# EAGLE design Oxygen Sensor & CO2 PWM (EAGLE 9.5.1)
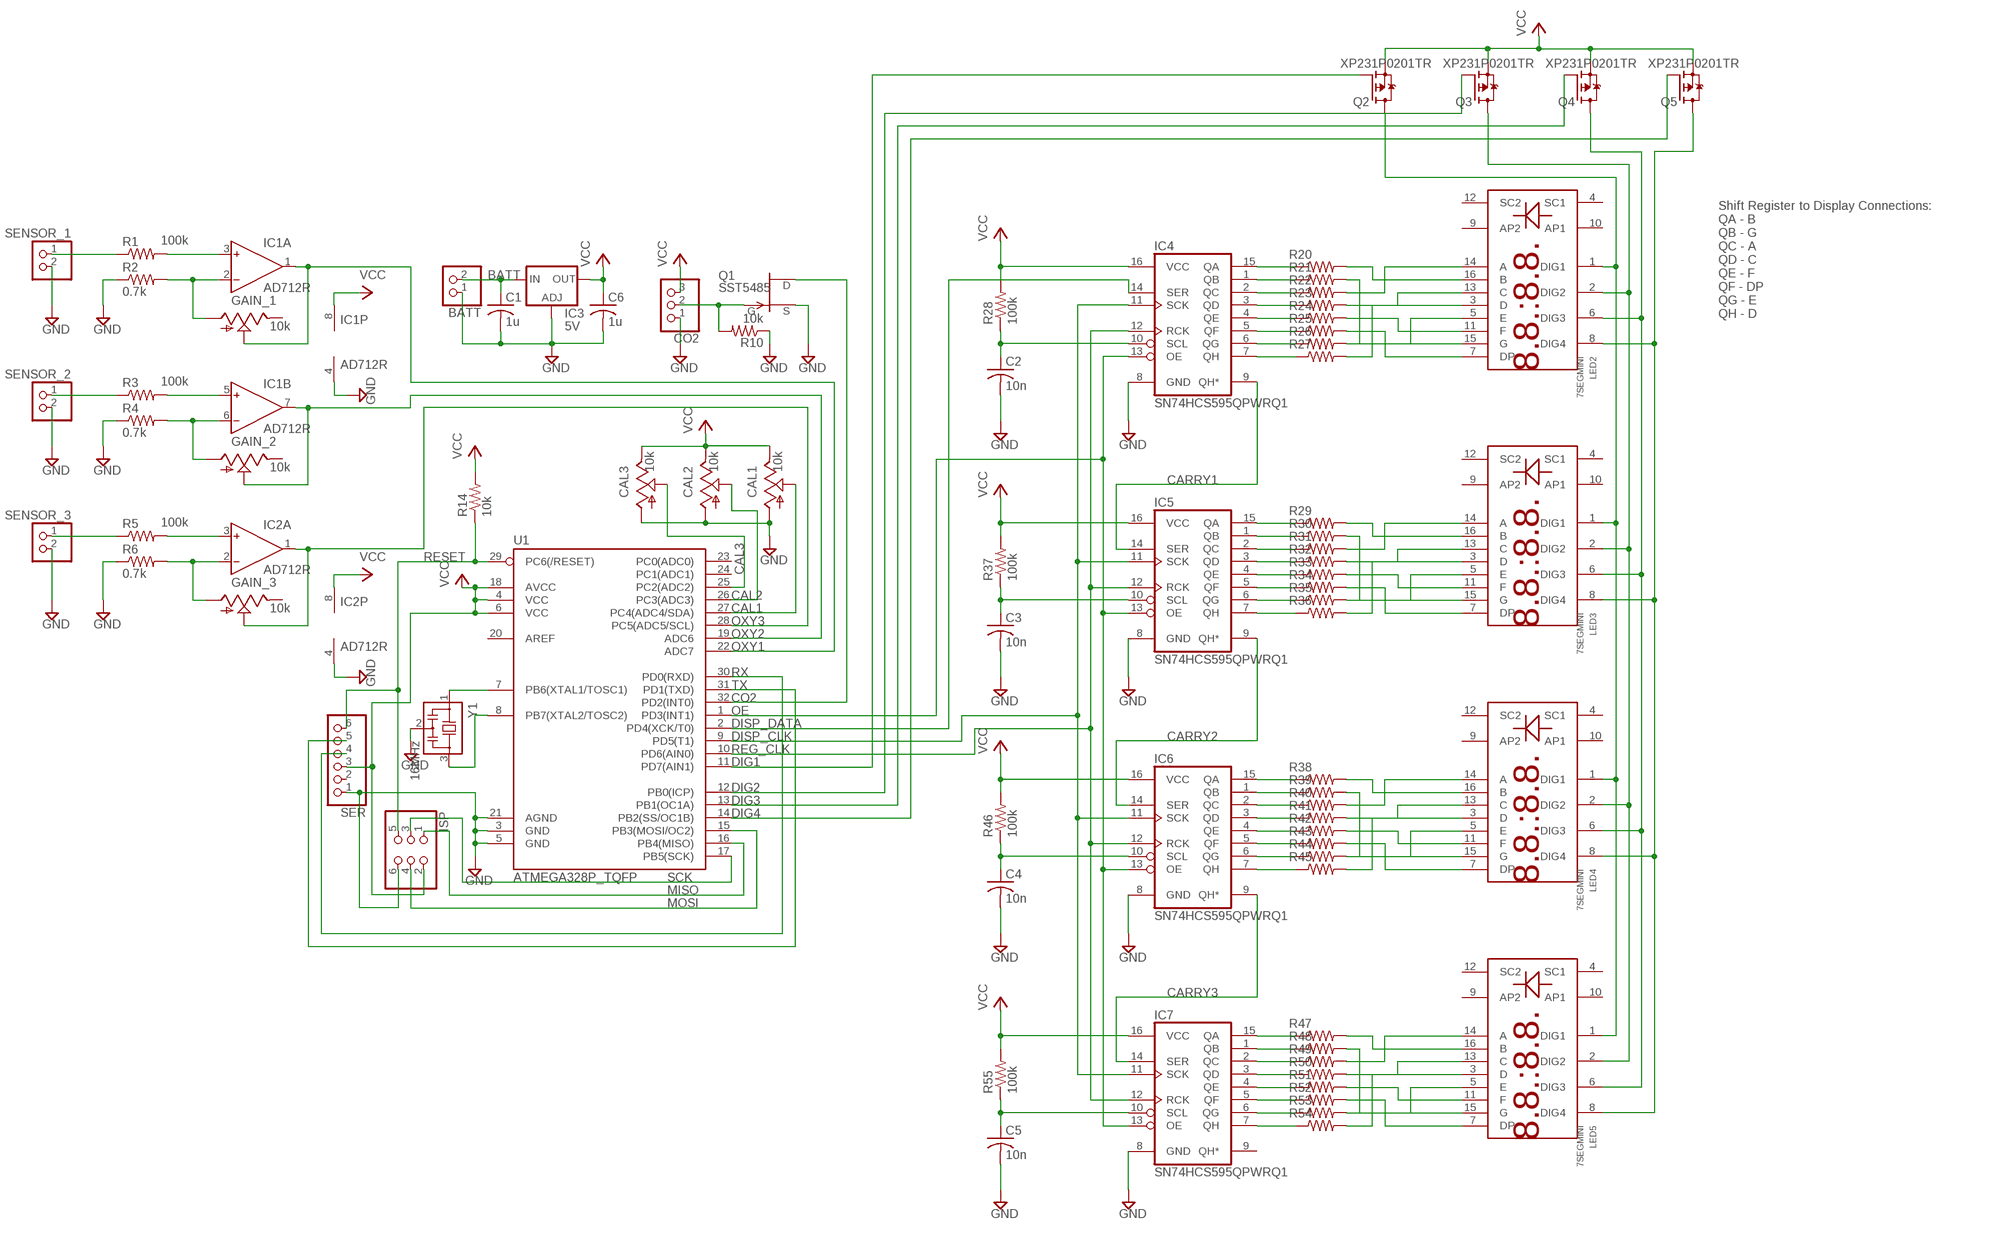
[diagram p0: schematic, sheet 1]

## Parts
BATT  BATT  PINHD-1X2  [1X02]
C1  1u  C-USC0603  [C0603]
C2  10n  C-USC0603  [C0603]
C3  10n  C-USC0603  [C0603]
C4  10n  C-USC0603  [C0603]
C5  10n  C-USC0603  [C0603]
C6  1u  C-USC0603  [C0603]
CAL1  10k  TRIM_US-RJ9W  [RJ9W]
CAL2  10k  TRIM_US-RJ9W  [RJ9W]
CAL3  10k  TRIM_US-RJ9W  [RJ9W]
CO2  CO2  PINHD-1X3  [1X03]
GAIN_1  10k  TRIM_US-RJ9W  [RJ9W]
GAIN_2  10k  TRIM_US-RJ9W  [RJ9W]
GAIN_3  10k  TRIM_US-RJ9W  [RJ9W]
IC1  AD712R  [SO8]
IC2  AD712R  [SO8]
IC3  5V  LD117ASTR  [SOT223]
IC4  SN74HCS595QPWRQ1  [TSSOP16]
IC5  SN74HCS595QPWRQ1  [TSSOP16]
IC6  SN74HCS595QPWRQ1  [TSSOP16]
IC7  SN74HCS595QPWRQ1  [TSSOP16]
ISP  ISP  PINHD-2X3  [2X03]
LED2  7SEGMINI  [7SEGMINI]
LED3  7SEGMINI  [7SEGMINI]
LED4  7SEGMINI  [7SEGMINI]
LED5  7SEGMINI  [7SEGMINI]
Q1  SST5485  [SOT23]
Q2  XP231P0201TR  [SOT23]
Q3  XP231P0201TR  [SOT23]
Q4  XP231P0201TR  [SOT23]
Q5  XP231P0201TR  [SOT23]
R1  100k  R-US_R0603  [R0603]
R2  0.7k  R-US_R0603  [R0603]
R3  100k  R-US_R0603  [R0603]
R4  0.7k  R-US_R0603  [R0603]
R5  100k  R-US_R0603  [R0603]
R6  0.7k  R-US_R0603  [R0603]
R10  10k  R-US_R0603  [R0603]
R14  10k  R-US_R0603  [R0603]
R20  R-US_R0603  [R0603]
R21  R-US_R0603  [R0603]
R22  R-US_R0603  [R0603]
R23  R-US_R0603  [R0603]
R24  R-US_R0603  [R0603]
R25  R-US_R0603  [R0603]
R26  R-US_R0603  [R0603]
R27  R-US_R0603  [R0603]
R28  100k  R-US_R0603  [R0603]
R29  R-US_R0603  [R0603]
R30  R-US_R0603  [R0603]
R31  R-US_R0603  [R0603]
R32  R-US_R0603  [R0603]
R33  R-US_R0603  [R0603]
R34  R-US_R0603  [R0603]
R35  R-US_R0603  [R0603]
R36  R-US_R0603  [R0603]
R37  100k  R-US_R0603  [R0603]
R38  R-US_R0603  [R0603]
R39  R-US_R0603  [R0603]
R40  R-US_R0603  [R0603]
R41  R-US_R0603  [R0603]
R42  R-US_R0603  [R0603]
R43  R-US_R0603  [R0603]
R44  R-US_R0603  [R0603]
R45  R-US_R0603  [R0603]
R46  100k  R-US_R0603  [R0603]
R47  R-US_R0603  [R0603]
R48  R-US_R0603  [R0603]
R49  R-US_R0603  [R0603]
R50  R-US_R0603  [R0603]
R51  R-US_R0603  [R0603]
R52  R-US_R0603  [R0603]
R53  R-US_R0603  [R0603]
R54  R-US_R0603  [R0603]
R55  100k  R-US_R0603  [R0603]
SENSOR_1  PINHD-1X2  [1X02]
SENSOR_2  PINHD-1X2  [1X02]
SENSOR_3  PINHD-1X2  [1X02]
SER  SER  PINHD-1X6  [1X06]
U1  ATMEGA328P_TQFP  [TQFP32-08]
Y1  16MHz  CSTNE16M0V530000R0  [CSTCR6M]

## Nets
BATT: BATT.2 C1.1 IC3.3(IN)
CAL1: CAL1.S U1.27(PC4(ADC4/SDA))
CAL2: CAL2.S U1.26(PC3(ADC3))
CAL3: CAL3.S U1.25(PC2(ADC2))
CARRY1: IC4.9(QH*) IC5.14(SER)
CARRY2: IC5.9(QH*) IC6.14(SER)
CARRY3: IC6.9(QH*) IC7.14(SER)
CO2: Q1.1(D) U1.32(PD2(INT0))
CO2_PWM: CO2.2 Q1.3(G) R10.2
COM_D1: LED2.1(DIG1) LED3.1(DIG1) LED4.1(DIG1) LED5.1(DIG1) Q2.3(D)
COM_D2: LED2.2(DIG2) LED3.2(DIG2) LED4.2(DIG2) LED5.2(DIG2) Q3.3(D)
COM_D3: LED2.6(DIG3) LED3.6(DIG3) LED4.6(DIG3) LED5.6(DIG3) Q4.3(D)
COM_D4: LED2.8(DIG4) LED3.8(DIG4) LED4.8(DIG4) LED5.8(DIG4) Q5.3(D)
DIG1: Q2.1(G) U1.11(PD7(AIN1))
DIG2: Q3.1(G) U1.12(PB0(ICP))
DIG3: Q4.1(G) U1.13(PB1(OC1A))
DIG4: Q5.1(G) U1.14(PB2(SS/OC1B))
DISP_CLK: IC4.11(SCK) IC5.11(SCK) IC6.11(SCK) IC7.11(SCK) U1.9(PD5(T1))
DISP_DATA: IC4.14(SER) U1.2(PD4(XCK/T0))
GND: BATT.1 C1.2 C2.2 C3.2 C4.2 C5.2 C6.2 CAL1.A CAL2.A CAL3.A CO2.1 IC1.4(P:V-) IC2.4(P:V-) IC3.1(ADJ) IC4.8(GND) IC5.8(GND) IC6.8(GND) IC7.8(GND) ISP.6 Q1.2(S) R2.1 R4.1 R6.1 R10.1 SENSOR_1.2 SENSOR_2.2 SENSOR_3.2 SER.1 U1.3(GND) U1.5(GND) U1.21(AGND) Y1.2
MISO: ISP.1 U1.16(PB4(MISO))
MOSI: ISP.4 U1.15(PB3(MOSI/OC2))
N$2: IC1.3(A:IN+) R1.2
N$3: GAIN_1.A IC1.2(A:IN-) R2.2
N$8: IC1.5(B:IN+) R3.2
N$9: GAIN_2.A IC1.6(B:IN-) R4.2
N$11: IC2.3(A:IN+) R5.2
N$12: GAIN_3.A IC2.2(A:IN-) R6.2
N$23: U1.7(PB6(XTAL1/TOSC1)) Y1.1
N$24: U1.8(PB7(XTAL2/TOSC2)) Y1.3
N$30: IC4.15(QA) R20.1
N$31: IC4.1(QB) R21.1
N$32: IC4.2(QC) R22.1
N$33: IC4.3(QD) R23.1
N$34: IC4.4(QE) R24.1
N$35: IC4.5(QF) R25.1
N$36: IC4.6(QG) R26.1
N$37: IC4.7(QH) R27.1
N$38: C2.1 IC4.10(SCL) R28.1
N$39: LED2.16(B) R20.2
N$40: LED2.15(G) R21.2
N$41: LED2.14(A) R22.2
N$42: LED2.13(C) R23.2
N$43: LED2.11(F) R24.2
N$44: LED2.7(DP) R25.2
N$45: LED2.5(E) R26.2
N$46: LED2.3(D) R27.2
N$47: IC5.15(QA) R29.1
N$48: IC5.1(QB) R30.1
N$49: IC5.2(QC) R31.1
N$50: IC5.3(QD) R32.1
N$51: IC5.4(QE) R33.1
N$52: IC5.5(QF) R34.1
N$53: IC5.6(QG) R35.1
N$54: IC5.7(QH) R36.1
N$55: C3.1 IC5.10(SCL) R37.1
N$56: LED3.16(B) R29.2
N$57: LED3.15(G) R30.2
N$58: LED3.14(A) R31.2
N$59: LED3.13(C) R32.2
N$60: LED3.11(F) R33.2
N$61: LED3.7(DP) R34.2
N$62: LED3.5(E) R35.2
N$63: LED3.3(D) R36.2
N$64: IC6.15(QA) R38.1
N$65: IC6.1(QB) R39.1
N$66: IC6.2(QC) R40.1
N$67: IC6.3(QD) R41.1
N$68: IC6.4(QE) R42.1
N$69: IC6.5(QF) R43.1
N$70: IC6.6(QG) R44.1
N$71: IC6.7(QH) R45.1
N$72: C4.1 IC6.10(SCL) R46.1
N$73: LED4.16(B) R38.2
N$74: LED4.15(G) R39.2
N$75: LED4.14(A) R40.2
N$76: LED4.13(C) R41.2
N$77: LED4.11(F) R42.2
N$78: LED4.7(DP) R43.2
N$79: LED4.5(E) R44.2
N$80: LED4.3(D) R45.2
N$81: IC7.15(QA) R47.1
N$82: IC7.1(QB) R48.1
N$83: IC7.2(QC) R49.1
N$84: IC7.3(QD) R50.1
N$85: IC7.4(QE) R51.1
N$86: IC7.5(QF) R52.1
N$87: IC7.6(QG) R53.1
N$88: IC7.7(QH) R54.1
N$89: C5.1 IC7.10(SCL) R55.1
N$90: LED5.16(B) R47.2
N$91: LED5.15(G) R48.2
N$92: LED5.14(A) R49.2
N$93: LED5.13(C) R50.2
N$94: LED5.11(F) R51.2
N$95: LED5.7(DP) R52.2
N$96: LED5.5(E) R53.2
N$97: LED5.3(D) R54.2
O2SENS_1: R1.1 SENSOR_1.1
O2SENS_2: R3.1 SENSOR_2.1
O2SENS_3: R5.1 SENSOR_3.1
OE: IC4.13(OE) IC5.13(OE) IC6.13(OE) IC7.13(OE) U1.1(PD3(INT1))
OXY1: GAIN_1.S IC1.1(A:OUT) U1.22(ADC7)
OXY2: GAIN_2.S IC1.7(B:OUT) U1.19(ADC6)
OXY3: GAIN_3.S IC2.1(A:OUT) U1.28(PC5(ADC5/SCL))
REG_CLK: IC4.12(RCK) IC5.12(RCK) IC6.12(RCK) IC7.12(RCK) U1.10(PD6(AIN0))
RESET: ISP.5 R14.1 SER.6 U1.29(PC6(/RESET))
RX: SER.4 U1.30(PD0(RXD))
SCK: ISP.3 U1.17(PB5(SCK))
TX: SER.5 U1.31(PD1(TXD))
VCC: C6.1 CAL1.E CAL2.E CAL3.E CO2.3 IC1.8(P:V+) IC2.8(P:V+) IC3.4(OUT) IC4.16(VCC) IC5.16(VCC) IC6.16(VCC) IC7.16(VCC) ISP.2 Q2.2(S) Q3.2(S) Q4.2(S) Q5.2(S) R14.2 R28.2 R37.2 R46.2 R55.2 SER.3 U1.4(VCC) U1.6(VCC) U1.18(AVCC)
Unconnected: GAIN_1.E GAIN_2.E GAIN_3.E IC2.5(B:IN+) IC2.6(B:IN-) IC2.7(B:OUT) IC7.9(QH*) LED2.4(SC1) LED2.9(AP2) LED2.10(AP1) LED2.12(SC2) LED3.4(SC1) LED3.9(AP2) LED3.10(AP1) LED3.12(SC2) LED4.4(SC1) LED4.9(AP2) LED4.10(AP1) LED4.12(SC2) LED5.4(SC1) LED5.9(AP2) LED5.10(AP1) LED5.12(SC2) SER.2 U1.20(AREF) U1.23(PC0(ADC0)) U1.24(PC1(ADC1))

## Notes on the sheet
- Shift Register to Display Connections:
  QA - B
  QB - G
  QC - A
  QD - C
  QE - F
  QF - DP
  QG - E
  QH - D

## Library data of the parts
BATT SENSOR_1-SENSOR_3 = pinhead:PINHD-1X2: PIN HEADER
C1-C6 = rcl:C-US: CAPACITOR, American symbol; SPICEPREFIX: C
CAL1-CAL3 GAIN_1-GAIN_3 = pot:TRIM_US-: POTENTIOMETER
CO2 = pinhead:PINHD-1X3: PIN HEADER
IC1 IC2 = analog-devices:AD712: Dual Precision, Low Cost, High Speed BiFET Op Amp Source: http://www.analog.com/static/imported-files/data_sheets/AD712.pdf; MF: ALTERA CORPORATION; MPN: AD712KRZ; OC_FARNELL: 1263975; OC_NEWARK: 59K4556
IC3 = v-reg:LD117A?*: Low drop fixed and adjustable positive voltage regulators 1 A Source: http://www.st.com/stonline/products/literature/ds/7194/ld1117axx.pdf
IC4-IC7 = axios_components:SN74HCS595QPWRQ1
ISP = pinhead:PINHD-2X3: PIN HEADER
LED2-LED5 = axios_components:7SEGMINI
Q1 = transistor-fet:?548*: N-Channel JFETs Source: VISHAY 2N5484.pdf Compatible: TO92 2N5245 J304 J305 U310 J308 J309 J310 TO72 2N4416 2N4416A 2N3823 2N4351 3N169 3N170 3N171 MFE3002 TO18 2N3796 2N3797 MFE825 Source: Motorola European Master Guide Pacge 3-59
Q2-Q5 = axios_components:XP231P0201TR: P-Channel Enhancement mode MOSFET 200 mA
R1-R6 R10 R14 R20-R55 = rcl:R-US_: RESISTOR, American symbol; SPICEPREFIX: R
SER = pinhead:PINHD-1X6: PIN HEADER
U1 = axios_components:ATMEGA328P_TQFP: Popular 328P in QFP Storefront component: ATmega328 - TQFP <https://www.sparkfun.com/products/13448> (COM-13448) Datasheet <http://www.sparkfun.com/datasheets/Components/SMD/ATMega328.pdf> SparkFun Products SparkFun RedBoard - Programmed with Arduino <https://www.sparkfun.com/products/12757> (DEV-12757) Arduino Pro Mini 328 - 5V/16MHz <https://www.sparkfun.com/products/11113> (DEV-11113) Arduino Pro Mini 328 - 3.3V/8MHz <https://www.sparkfun.com/products/11114> (DEV-11114) SparkFun OpenLog <https://www.sparkfun.com/products/13712> (DEV-13712) SparkFun MicroView - OLED Arduino Module <https://www.sparkfun.com/products/12923> (DEV-12923) SparkFun Digital Sandbox <https://www.sparkfun.com/products/12651> (DEV-12651) SparkFun PicoBoard <https://www.sparkfun.com/products/11888> (WIG-11888) Arduino Fio <https://www.sparkfun.com/products/10116> (DEV-10116) LilyPad Arduino 328 Main Board <https://www.sparkfun.com/products/13342> (DEV-13342) SparkFun RedStick <https://www.sparkfun.com/products/13741> (DEV-13741) LilyPad MP3 <https://www.sparkfun.com/products/11013> (DEV-11013) LilyPad Arduino SimpleSnap <https://www.sparkfun.com/products/10941> (DEV-10941) SparkFun Stepoko <https://www.sparkfun.com/products/13899> (ROB-13899) SparkFun Geiger Counter <https://www.sparkfun.com/products/11345> (SEN-11345) SparkFun EL Sequencer <https://www.sparkfun.com/products/12781> (COM-12781) Arduino Pro 328 - 5V/16MHz <https://www.sparkfun.com/products/10915> (DEV-10915) CryptoCape <https://www.sparkfun.com/products/12773> (DEV-12773) SparkFun IR Thermometer Evaluation Board - MLX90614 <https://www.sparkfun.com/products/10740> (SEN-10740) SparkFun RedBot Mainboard <https://www.sparkfun.com/products/12097> (ROB-12097) Arduino Pro 328 - 3.3V/8MHz <https://www.sparkfun.com/products/10914> (DEV-10914) SparkFun Block for Intel® Edison - Arduino <https://www.sparkfun.com/products/13036> (DEV-13036) SparkFun Simon Says - Surface Mount Soldering Kit <https://www.sparkfun.com/products/10935> (KIT-10935) SparkFun 7-Segment Serial Display - Red <https://www.sparkfun.com/products/11441> (COM-11441) SparkFun 7-Segment Serial Display - White <https://www.sparkfun.com/products/11629> (COM-11629) SparkFun 7-Segment Serial Display - Yellow <https://www.sparkfun.com/products/11443> (COM-11443) SparkFun 7-Segment Serial Display - Kelly Green <https://www.sparkfun.com/products/11440> (COM-11440) SparkFun 7-Segment Serial Display - Blue <https://www.sparkfun.com/products/11442> (COM-11442) SparkFun OpenSegment Serial Display - 20mm (Blue) <https://www.sparkfun.com/products/11647> (COM-11647) SparkFun OpenSegment Serial Display - 20mm (Green) <https://www.sparkfun.com/products/11646> (COM-11646) SparkFun OpenSegment Serial Display - 20mm (White) <https://www.sparkfun.com/products/11648> (COM-11648) SparkFun OpenSegment Serial Display - 20mm (Red) <https://www.sparkfun.com/products/11644> (COM-11644) SparkFun OpenSegment Serial Display - 20mm (Yellow) <https://www.sparkfun.com/products/11645> (COM-11645) SparkFun OpenSegment Shield <https://www.sparkfun.com/products/13190> (DEV-13190); PROD_ID: IC-09069
Y1 = axios_components:CSTNE16M0V530000R0

## Board
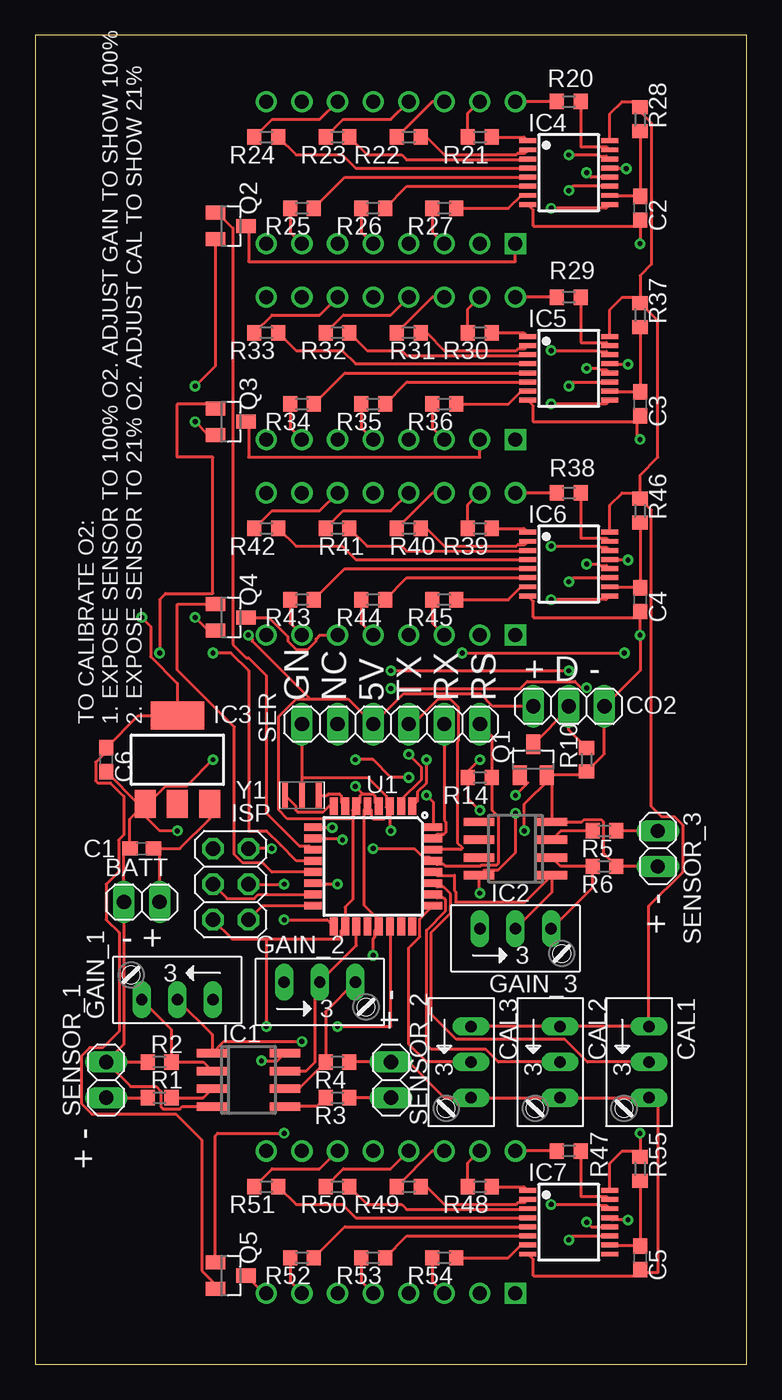
[diagram p1: board, top side]
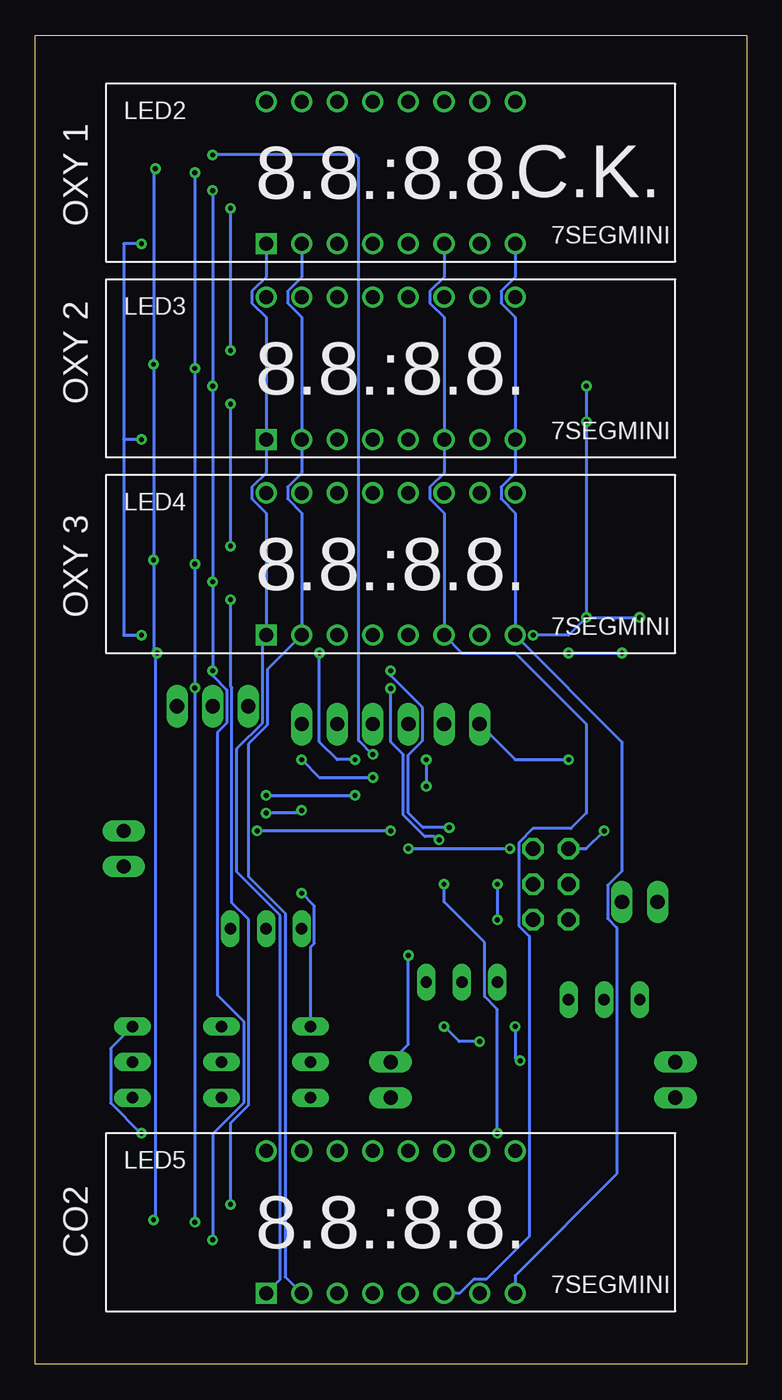
[diagram p2: board, bottom side, seen from below]

Size 50.78 x 94.92 mm. Coordinates in mm from the lower left corner, seen from the top.
Outline: 0,0 50.78,0 50.78,94.92 0,94.92 0,0
Copper layers (1*16): Top 0.035mm / dielectric 1.5mm / Bottom 0.035mm
Design rules "default": minimum track width 6mil, minimum drill 0.35mm, track to track 6mil, track to pad 6mil, pad to pad 6mil, via to via 6mil, smd to smd 6mil, copper to edge 40mil, drill to drill 6mil, minimum pad ring 10mil, minimum via ring 8mil, stop-mask expansion 4mil, vias tented up to drill 0mil, thermal gap 10mil

### Footprints (pad centres in the part's own frame; a part is rotated, then mirrored left to right if it is on the bottom)
1X02 = drill 1.016 long: 1 -1.27,0; 2 1.27,0
C0603 = smd 1.1 x 1: 1 -0.85,0; 2 0.85,0
RJ9W = drill 0.813 long: A 2.54,0.635; E -2.54,0.635; S 0,0.635
1X03 = drill 1.016 long: 1 -2.54,0; 2 0,0; 3 2.54,0
SO8 = smd 0.6 x 2.2: 1 -1.905,-2.6; 2 -0.635,-2.6; 3 0.635,-2.6; 4 1.905,-2.6; 5 1.905,2.6; 6 0.635,2.6; 7 -0.635,2.6; 8 -1.905,2.6
SOT223 = smd 1.5 x 2: 1 -2.3,-3.15; 2 0,-3.15; 3 2.3,-3.15 | smd 3.8 x 2: 4 0,3.15
TSSOP16 = smd 0.35 x 1.2: 1 -2.275,-2.925; 2 -1.625,-2.925; 3 -0.975,-2.925; 4 -0.325,-2.925; 5 0.325,-2.925; 6 0.975,-2.925; 7 1.625,-2.925; 8 2.275,-2.925; 9 2.275,2.925; 10 1.625,2.925; 11 0.975,2.925; 12 0.325,2.925; 13 -0.325,2.925; 14 -0.975,2.925; 15 -1.625,2.925; 16 -2.275,2.925
2X03 = drill 1.016 octagon: 1 -2.54,-1.27; 2 -2.54,1.27; 3 0,-1.27; 4 0,1.27; 5 2.54,-1.27; 6 2.54,1.27
7SEGMINI = drill 1 square: 1 -8.89,-5.08 | drill 1: 2 -6.35,-5.08; 3 -3.81,-5.08; 4 -1.27,-5.08; 5 1.27,-5.08; 6 3.81,-5.08; 7 6.35,-5.08; 8 8.89,-5.08; 9 8.89,5.08; 10 6.35,5.08; 11 3.81,5.08; 12 1.27,5.08; 13 -1.27,5.08; 14 -3.81,5.08; 15 -6.35,5.08; 16 -8.89,5.08
SOT23 = smd 1 x 1.4: 1 -0.95,-1.1; 2 0.95,-1.1; 3 0,1.1
R0603 = smd 1 x 1.1: 1 -0.85,0; 2 0.85,0
1X06 = drill 1.016 long: 1 -6.35,0; 2 -3.81,0; 3 -1.27,0; 4 1.27,0; 5 3.81,0; 6 6.35,0
TQFP32-08 = smd 1.27 x 0.559: 1 -4.293,2.8; 2 -4.293,2; 3 -4.293,1.2; 4 -4.293,0.4; 5 -4.293,-0.4; 6 -4.293,-1.2; 7 -4.293,-2; 8 -4.293,-2.8; 17 4.293,-2.8; 18 4.293,-2; 19 4.293,-1.2; 20 4.293,-0.4; 21 4.293,0.4; 22 4.293,1.2; 23 4.293,2; 24 4.293,2.8 | smd 0.559 x 1.27: 9 -2.8,-4.293; 10 -2,-4.293; 11 -1.2,-4.293; 12 -0.4,-4.293; 13 0.4,-4.293; 14 1.2,-4.293; 15 2,-4.293; 16 2.8,-4.293; 25 2.8,4.293; 26 2,4.293; 27 1.2,4.293; 28 0.4,4.293; 29 -0.4,4.293; 30 -1.2,4.293; 31 -2,4.293; 32 -2.8,4.293
CSTCR6M = smd 0.4 x 1.9: 1 -1.2,0; 2 0,0; 3 1.2,0

### Placement (x,y rotation side)
BATT  7.62,33.02 0 top
C1  7.62,36.83 180 top
C2  43.18,82.55 270 top
C3  43.18,68.58 270 top
C4  43.18,54.61 270 top
C5  43.18,7.62 270 top
C6  5.08,43.18 270 top
CAL1  43.18,21.59 270 top
CAL2  36.83,21.59 270 top
CAL3  30.48,21.59 270 top
CO2  38.1,46.99 180 top
GAIN_1  10.16,26.67 180 top
GAIN_2  20.32,26.67 0 top
GAIN_3  34.29,30.48 0 top
IC1  15.24,20.32 270 top
IC2  34.29,36.83 90 top
IC3  10.16,43.18 0 top
IC4  38.1,85.09 270 top
IC5  38.1,71.12 270 top
IC6  38.1,57.15 270 top
IC7  38.1,10.16 270 top
ISP  13.97,34.29 90 top
LED2  25.4,85.09 0 bottom
LED3  25.4,71.12 0 bottom
LED4  25.4,57.15 0 bottom
LED5  25.4,10.16 0 bottom
Q1  35.56,43.18 0 top
Q2  13.97,81.28 270 top
Q3  13.97,67.31 270 top
Q4  13.97,53.34 270 top
Q5  13.97,6.35 270 top
R1  8.89,19.05 0 top
R2  8.89,21.59 0 top
R3  21.59,19.05 180 top
R4  21.59,21.59 180 top
R5  40.64,38.1 180 top
R6  40.64,35.56 180 top
R10  39.37,43.18 90 top
R14  31.75,41.91 180 top
R20  38.1,90.17 180 top
R21  31.75,87.63 180 top
R22  26.67,87.63 180 top
R23  21.59,87.63 180 top
R24  16.51,87.63 180 top
R25  19.05,82.55 180 top
R26  24.13,82.55 180 top
R27  29.21,82.55 180 top
R28  43.18,88.9 90 top
R29  38.1,76.2 180 top
R30  31.75,73.66 180 top
R31  26.67,73.66 180 top
R32  21.59,73.66 180 top
R33  16.51,73.66 180 top
R34  19.05,68.58 180 top
R35  24.13,68.58 180 top
R36  29.21,68.58 180 top
R37  43.18,74.93 90 top
R38  38.1,62.23 180 top
R39  31.75,59.69 180 top
R40  26.67,59.69 180 top
R41  21.59,59.69 180 top
R42  16.51,59.69 180 top
R43  19.05,54.61 180 top
R44  24.13,54.61 180 top
R45  29.21,54.61 180 top
R46  43.18,60.96 90 top
R47  38.1,15.24 180 top
R48  31.75,12.7 180 top
R49  26.67,12.7 180 top
R50  21.59,12.7 180 top
R51  16.51,12.7 180 top
R52  19.05,7.62 180 top
R53  24.13,7.62 180 top
R54  29.21,7.62 180 top
R55  43.18,13.97 90 top
SENSOR_1  5.08,20.32 90 top
SENSOR_2  25.4,20.32 90 top
SENSOR_3  44.45,36.83 270 top
SER  25.4,45.72 0 top
U1  24.13,35.56 270 top
Y1  19.05,40.64 180 top

### Tracks (layer width: path | path; a pad name or v marks a point on that pad's centre or on a via)
BATT
  Top 0.203: BATT.2 8.89,36.41 C1.1 10.34,36.83 12.46,38.95 IC3.3
CAL1
  Top 0.203: CAL1.S 39.42,21.59 37.79,23.22 30.08,23.22 28.3,25 28.3,30.86 29.67,32.23 29.67,33.59 29.16,34.09 28.69,34.09 U1.27
CAL2
  Top 0.203: CAL2.S 33.07,21.59 32.15,22.5 28.3,22.5 27.94,22.86 27.94,31 29.31,32.38 29.31,33.15 29.16,33.29 28.69,33.29 U1.26
CAL3
  Top 0.203: CAL3.S 27.94,21.59 26.67,22.86 26.67,29.73 27.46,30.53 27.46,31.8 U1.25
CARRY1  (via drill 0.35)
  Top 0.203: IC4.9 40.76,82.55 v36.83,82.55 | v36.83,72.39 40.25,72.39 40.32,72.32 40.8,72.32 IC5.14
  Bottom 0.203: v36.83,82.55 v36.83,72.39
CARRY2  (via drill 0.35)
  Top 0.203: IC5.9 40.76,68.58 v36.83,68.58 | v36.83,58.42 40.25,58.42 40.32,58.35 40.8,58.35 IC6.14
  Bottom 0.203: v36.83,68.58 v36.83,58.42
CARRY3  (via drill 0.35)
  Top 0.203: IC6.9 40.76,54.61 v36.83,54.61 | v36.83,11.43 40.25,11.43 40.32,11.36 40.8,11.36 IC7.14
  Bottom 0.203: v36.83,54.61 36.83,48.42 36.73,48.32 36.73,32.97 35.54,31.77 35.54,18.52 36.83,17.23 v36.83,11.43
CO2  (via drill 0.35)
  Top 0.203: Q1.1 35.17,41.52 v34.29,40.64 | v27.94,40.64 28.42,40.16 U1.32
  Bottom 0.203: v34.29,40.64 v27.94,40.64
CO2_PWM
  Top 0.203: R10.2 38.1,45.3 CO2.2 38.1,46.82 Q1.3
COM_D1
  Top 0.203: Q2.3 15.24,81.11 15.24,78.74 34.29,78.74 LED2.1
  Bottom 0.203: LED2.1 34.29,77.63 35.3,76.62 35.3,75.78 34.29,74.77 LED3.1 34.29,63.66 35.3,62.65 35.3,61.81 34.29,60.8 LED4.1 34.54,51.82 34.54,45.81 36.37,43.98 36.37,35.15 33.28,32.06 33.28,6.09 LED5.1
COM_D2
  Top 0.203: Q3.3 15.24,67.14 15.24,64.77 31.75,64.77 LED3.2
  Bottom 0.203: LED2.2 31.75,77.63 32.76,76.62 32.76,75.78 31.75,74.77 LED3.2 31.75,63.66 32.76,62.65 32.76,61.81 31.75,60.8 LED4.2 34.19,49.63 34.19,45.66 35.56,44.29 35.56,34.84 32.93,32.21 32.93,6.26 LED5.2
COM_D3
  Top 0.203: Q4.3 16.67,53.34 18.04,51.96 18.04,51.65 18.63,51.06 19.47,51.06 20.06,51.65 20.06,51.81 20.32,52.07 LED4.6
  Bottom 0.203: LED2.6 21.59,77.63 22.6,76.62 22.6,75.78 21.59,74.77 LED3.6 21.59,63.66 22.6,62.65 22.6,61.81 21.59,60.8 LED4.6 20.32,50.8 16.51,50.8 11.43,45.72 11.43,39.37 12.53,38.27 15.24,38.27 16.26,37.25 16.26,31.33 15.5,30.57 15.5,9.15 18.57,6.09 19.47,6.09 20.48,5.08 LED5.6
COM_D4
  Top 0.203: Q5.3 16.34,5.08 LED5.8
  Bottom 0.203: LED2.8 16.51,77.63 17.52,76.62 17.52,75.78 16.51,74.77 LED3.8 16.51,63.66 17.52,62.65 17.52,61.81 16.51,60.8 LED4.8 8.89,44.45 8.89,35.22 9.91,34.2 9.91,31.84 9.25,31.18 9.25,13.61 16.51,6.35 LED5.8
DIG1
  Top 0.203: U1.11 19.57,37.03 18.85,37.03 16.51,39.37 16.51,49.17 15.24,50.44 15.09,50.44 14.12,51.42 14.12,81.13 13.02,82.23 Q2.1
DIG2  (via drill 0.35)
  Top 0.152: 12.55,68.58 Q3.1
  Top 0.203: U1.12 18.65,35.96 17.52,37.09 16.51,38.1 15.24,38.1 15.24,49.53 13.97,50.8 v12.7,50.8 | v8.89,50.8 8.89,54.61 9.32,55.04 12.7,55.04 12.7,64.77 10.16,64.77 10.16,68.58 12.55,68.58
  Bottom 0.203: v12.7,50.8 v8.89,50.8
DIG3
  Top 0.203: U1.13 16.91,35.16 16.26,35.81 14.82,35.81 14.22,36.41 14.22,45.52 10.16,49.59 10.16,54.29 Q4.1
DIG4  (via drill 0.35)
  Top 0.203: Q5.1 12.87,16.34 13.04,16.51 v17.78,16.51 | v21.59,34.29 19.91,34.29 U1.14
  Bottom 0.203: v17.78,16.51 17.78,25.35 18.69,26.27 18.69,30.12 21.59,33.02 v21.59,34.29
DISP_CLK  (via drill 0.35)
  Top 0.203: IC4.11 38.4,84.11 v38.1,83.82 | v38.1,69.85 38.4,70.14 IC5.11 | v38.1,55.88 38.4,56.17 IC6.11 | v38.1,8.89 38.4,9.19 IC7.11 | U1.9 21.19,38.36 v21.22,38.33 | v25.4,49.53 v38.1,49.53
  Bottom 0.203: v38.1,83.82 v38.1,69.85 v38.1,55.88 v38.1,49.53 38.1,49.19 37.08,48.17 37.08,45.81 37.74,45.15 37.74,26.36 35.89,24.51 35.89,18.67 38.1,16.46 v38.1,8.89 | v21.22,38.33 23.09,38.33 24.13,39.37 24.13,43.52 23.11,44.54 23.11,46.9 25.4,49.19 v25.4,49.53
DISP_DATA  (via drill 0.35)
  Top 0.203: v38.1,86.36 40.25,86.36 40.32,86.29 40.8,86.29 IC4.14 | U1.2 26.13,40.33 27.58,41.78 27.58,42.64 27.31,42.92 v26.67,43.56
  Bottom 0.203: v26.67,43.56 26.71,43.56 27.69,44.54 27.69,86.11 27.94,86.36 v38.1,86.36
GND  (via drill 0.35)
  Top 0.203: IC4.8 35.56,82.43 35.56,81.28 42.76,81.28 C2.2 v43.18,80.01 | 42.97,67.52 42.76,67.31 35.56,67.31 35.56,68.46 IC5.8 | 42.97,67.52 C3.2 | IC6.8 35.56,54.49 35.56,53.34 42.76,53.34 C4.2 v43.18,52.07 43.18,49.53 CO2.1 40.64,43.6 R10.1 39.12,42.08 Q1.2 36.76,41.84 | 42.97,6.56 42.76,6.35 35.56,6.35 35.56,7.5 IC7.8 | 42.97,6.56 C5.2 | SENSOR_3.2 R6.1 40.54,36.51 40.54,38.76 40.4,38.9 39.19,38.9 39.02,38.73 IC2.4 36.89,41.7 36.76,41.84 | R4.1 SENSOR_2.2 26.67,21.59 29.21,19.05 CAL3.A CAL2.A CAL1.A 44.45,18.41 44.45,6.56 42.97,6.56 | SENSOR_1.2 R2.1 | 7.41,39.58 6.77,38.94 C1.2 6.35,36.41 BATT.1 6.35,22.86 SENSOR_1.2 | 7.41,39.58 IC3.1 | C6.2 7.38,40.03 IC3.1 | 25.33,39.37 U1.3 25.33,38.17 v25.4,38.1 | 25.33,39.37 25.32,39.37 24.91,38.96 24.14,38.96 24,39.11 24,39.59 U1.5 23.46,39.59 23.46,32.81 24.53,31.74 U1.21 24.26,31 24.26,30.53 24.13,30.39 v24.13,29.21 | 25.33,39.37 25.4,39.44 25.06,39.78 25.06,40.59 23.75,41.91 19.05,41.91 | SER.1 19.05,41.91 | 19.05,41.91 Y1.2 | v43.18,66.04 42.97,66.25 42.97,67.52 | v10.16,38.1 8.89,38.1 7.41,39.58 | IC1.4 10.51,18.41 10.34,18.25 9.13,18.25 8.99,18.39 8.99,19.51 8.64,19.85 6.82,19.85 SENSOR_1.2 | v34.93,38.1 34.93,40.01 36.76,41.84 | v12.7,43.18 10.8,41.28 9.3,41.28 8.05,40.03 IC3.1
  Bottom 0.203: v43.18,80.01 44.45,80.01 44.45,66.04 | v43.18,66.04 44.45,66.04 | 44.45,66.04 44.45,52.07 v43.18,52.07 | ISP.6 11.43,36.83 v10.16,38.1 | SENSOR_2.2 24.13,22.86 v24.13,29.21 | v25.4,38.1 v34.93,38.1 | SER.1 16.51,43.18 v12.7,43.18
MISO
  Top 0.203: ISP.1 16.25,32.76 U1.16
MOSI
  Top 0.203: U1.15 15.95,33.56 15.66,33.27 13.72,33.27 ISP.4
N$2
  Top 0.203: R1.2 12,19.05 IC1.3
N$3
  Top 0.203: IC1.2 12,21.59 R2.2 9.74,23.91 GAIN_1.A
N$8
  Top 0.203: R3.2 20.11,18.41 IC1.5
N$9
  Top 0.203: IC1.6 18.84,19.68 R4.2 20.74,25.18 GAIN_2.A
N$11
  Top 0.203: R5.2 37.53,38.1 IC2.3
N$12
  Top 0.203: IC2.2 37.53,35.56 R6.2 39.79,34.08 GAIN_3.A
N$23
  Top 0.203: Y1.1 20.84,40.64 20.95,40.74 21.71,40.74 21.86,40.59 21.86,40.12 U1.7
N$24
  Top 0.203: Y1.3 18.6,39.89 18.6,39.59 18.75,39.44 20.55,39.44 20.97,39.85 U1.8
N$30
  Top 0.203: IC4.15 40.8,86.94 38.95,86.94 R20.1
N$31
  Top 0.203: R21.1 34.91,87.63 IC4.1
N$32
  Top 0.203: R22.1 27.94,87.63 29.21,86.36 34.34,86.36 34.47,86.49 34.95,86.49 IC4.2
N$33
  Top 0.203: R23.1 23.71,86.36 26.17,86.36 26.52,86 35.11,86 IC4.3
N$34
  Top 0.203: R24.1 18.63,86.36 21.94,86.36 22.88,85.42 IC4.4
N$35
  Top 0.203: R25.1 22.11,84.77 IC4.5
N$36
  Top 0.203: R26.1 26.54,84.11 IC4.6
N$37
  Top 0.203: R27.1 33.78,82.55 34.69,83.47 IC4.7
N$38
  Top 0.203: R28.1 C2.1 41.09,83.4 IC4.10
N$39
  Top 0.203: R20.2 LED2.16
N$40
  Top 0.203: R21.2 30.9,89.32 LED2.15
N$41
  Top 0.203: LED2.14 28.36,90.17 R22.2
N$42
  Top 0.203: R23.2 22.01,88.9 25.4,88.9 LED2.13
N$43
  Top 0.203: R24.2 16.93,88.9 20.32,88.9 LED2.11
N$44
  Top 0.203: R25.2 18.2,80.86 LED2.7
N$45
  Top 0.203: R26.2 23.28,80.86 LED2.5
N$46
  Top 0.203: R27.2 28.36,80.86 LED2.3
N$47
  Top 0.203: IC5.15 40.8,72.97 38.95,72.97 R29.1
N$48
  Top 0.203: R30.1 34.91,73.66 IC5.1
N$49
  Top 0.203: R31.1 27.94,73.66 29.21,72.39 34.34,72.39 34.47,72.52 34.95,72.52 IC5.2
N$50
  Top 0.203: R32.1 23.71,72.39 26.17,72.39 26.52,72.03 35.11,72.03 IC5.3
N$51
  Top 0.203: R33.1 18.63,72.39 21.94,72.39 22.88,71.44 IC5.4
N$52
  Top 0.203: R34.1 22.11,70.8 IC5.5
N$53
  Top 0.203: R35.1 26.54,70.14 IC5.6
N$54
  Top 0.203: R36.1 33.78,68.58 34.69,69.5 IC5.7
N$55
  Top 0.203: R37.1 C3.1 41.09,69.43 IC5.10
N$56
  Top 0.203: R29.2 LED3.16
N$57
  Top 0.203: R30.2 30.9,75.35 LED3.15
N$58
  Top 0.203: LED3.14 28.36,76.2 R31.2
N$59
  Top 0.203: R32.2 22.01,74.93 25.4,74.93 LED3.13
N$60
  Top 0.203: R33.2 16.93,74.93 20.32,74.93 LED3.11
N$61
  Top 0.203: R34.2 18.2,66.89 LED3.7
N$62
  Top 0.203: R35.2 23.28,66.89 LED3.5
N$63
  Top 0.203: R36.2 28.36,66.89 LED3.3
N$64
  Top 0.203: IC6.15 40.8,59 38.95,59 R38.1
N$65
  Top 0.203: R39.1 34.91,59.69 IC6.1
N$66
  Top 0.203: R40.1 27.94,59.69 29.21,58.42 34.34,58.42 34.47,58.55 34.95,58.55 IC6.2
N$67
  Top 0.203: R41.1 23.71,58.42 26.17,58.42 26.52,58.06 35.11,58.06 IC6.3
N$68
  Top 0.203: R42.1 18.63,58.42 21.94,58.42 22.88,57.48 IC6.4
N$69
  Top 0.203: R43.1 22.11,56.83 IC6.5
N$70
  Top 0.203: R44.1 26.54,56.17 IC6.6
N$71
  Top 0.203: R45.1 33.78,54.61 34.69,55.52 IC6.7
N$72
  Top 0.203: R46.1 C4.1 41.09,55.46 IC6.10
N$73
  Top 0.203: R38.2 LED4.16
N$74
  Top 0.203: R39.2 30.9,61.38 LED4.15
N$75
  Top 0.203: LED4.14 28.36,62.23 R40.2
N$76
  Top 0.203: R41.2 22.01,60.96 25.4,60.96 LED4.13
N$77
  Top 0.203: R42.2 16.93,60.96 20.32,60.96 LED4.11
N$78
  Top 0.203: R43.2 18.2,52.92 LED4.7
N$79
  Top 0.203: R44.2 23.28,52.92 LED4.5
N$80
  Top 0.203: R45.2 28.36,52.92 LED4.3
N$81
  Top 0.203: IC7.15 40.8,12.01 38.95,12.01 R47.1
N$82
  Top 0.203: R48.1 34.91,12.7 IC7.1
N$83
  Top 0.203: R49.1 27.94,12.7 29.21,11.43 34.34,11.43 34.47,11.56 34.95,11.56 IC7.2
N$84
  Top 0.203: R50.1 23.71,11.43 26.17,11.43 26.52,11.07 35.11,11.07 IC7.3
N$85
  Top 0.203: R51.1 18.63,11.43 21.94,11.43 22.88,10.48 IC7.4
N$86
  Top 0.203: R52.1 22.11,9.84 IC7.5
N$87
  Top 0.203: R53.1 26.54,9.19 IC7.6
N$88
  Top 0.203: R54.1 33.78,7.62 34.69,8.54 IC7.7
N$89
  Top 0.203: R55.1 C5.1 41.09,8.47 IC7.10
N$90
  Top 0.203: R47.2 LED5.16
N$91
  Top 0.203: R48.2 30.9,14.39 LED5.15
N$92
  Top 0.203: LED5.14 28.36,15.24 R49.2
N$93
  Top 0.203: R50.2 22.01,13.97 25.4,13.97 LED5.13
N$94
  Top 0.203: R51.2 16.93,13.97 20.32,13.97 LED5.11
N$95
  Top 0.203: R52.2 18.2,5.93 LED5.7
N$96
  Top 0.203: R53.2 23.28,5.93 LED5.5
N$97
  Top 0.203: R54.2 28.36,5.93 LED5.3
O2SENS_1
  Top 0.203: SENSOR_1.1 R1.1
O2SENS_2
  Top 0.203: SENSOR_2.1 R3.1
O2SENS_3
  Top 0.203: SENSOR_3.1 R5.1
OE  (via drill 0.35)
  Top 0.203: IC4.13 42.15,85.42 v42.2,85.38 | v42.32,71.41 41.07,71.41 IC5.13 | v42.32,57.44 41.07,57.44 IC6.13 | v42.32,10.32 41.19,10.32 IC7.13 | U1.1 27.31,40.23 27.31,40.9 27.94,41.53 v27.94,43.18 | v30.48,50.8 v42.07,50.8
  Bottom 0.203: v42.2,85.38 42.32,85.25 v42.32,71.41 v42.32,57.44 42.32,51.05 v42.07,50.8 42.2,50.67 42.2,10.45 v42.32,10.32 | v27.94,43.18 29.21,43.18 30.48,44.45 v30.48,50.8
OXY1  (via drill 0.35)
  Top 0.203: GAIN_1.S 12.64,23.55 IC1.1 13.47,23.06 v19.05,23.06 | v21.59,24.13 25.4,24.13 25.4,31.2 U1.22
  Bottom 0.203: v19.05,23.06 20.52,23.06 v21.59,24.13
OXY2
  Top 0.203: U1.19 22.93,29.91 GAIN_2.S 19.99,26.97 19.99,21.59 19.35,20.95 IC1.7
OXY3
  Top 0.203: GAIN_3.S 36.89,33.72 IC2.1 34.99,33.02 30.02,33.02 30.02,33.74 29.93,33.83 29.93,34.92 28.66,34.92 U1.28
REG_CLK  (via drill 0.35)
  Top 0.203: IC4.12 39.7,84.77 v39.37,85.09 | v39.37,71.12 40.22,71.12 40.32,71.02 40.8,71.02 IC5.12 | v39.37,57.15 40.22,57.15 40.32,57.05 40.8,57.05 IC6.12 | v39.37,10.16 39.7,9.84 IC7.12 | U1.10 21.97,37.56 v21.94,37.46 | v25.4,48.26 34.63,48.26 35.14,48.77 38.52,48.77 38.98,48.31 v39.37,48.31
  Bottom 0.203: v39.37,85.09 v39.37,71.12 v39.37,57.15 v39.37,48.31 v39.37,10.16 | v21.94,37.46 22.31,37.7 22.96,37.7 24.49,39.22 24.49,43.54 25.4,44.45 v25.4,48.26
RESET  (via drill 0.35)
  Top 0.203: SER.6 32.6,44.87 R14.1 32.6,39.58 33.04,39.14 33.04,35.79 32.9,35.64 31.83,35.64 31.75,35.56 29.3,35.56 29.16,35.69 28.69,35.69 U1.29 28.16,36.23 27.68,36.23 27.08,36.83 v24.13,36.83 | v16.89,36.83 ISP.5
  Bottom 0.203: v24.13,36.83 v16.89,36.83
RX
  Top 0.203: U1.30 30.41,36.76 30.48,36.83 30.48,36.92 30.15,37.25 30.15,44.46 30.23,44.54 30.23,46.9 29.63,47.5 28.79,47.5 27.01,45.72 SER.4
SCK  (via drill 0.35)
  Top 0.203: ISP.3 v17.78,34.29 | v17.78,31.75 20.85,31.75 U1.17
  Bottom 0.203: v17.78,34.29 v17.78,31.75
TX
  Top 0.203: U1.31 28.69,37.83 29.16,37.83 29.31,37.98 29.31,38.74 29.21,38.85 SER.5
VCC  (via drill 0.35)
  Top 0.203: IC4.16 41.03,89.28 41.91,90.17 42.76,90.17 R28.2 43.18,89.46 43.98,88.66 43.98,78.56 43.18,77.75 R37.2 | IC5.16 41.03,75.31 41.91,76.2 42.76,76.2 R37.2 | IC6.16 41.03,61.34 41.91,62.23 42.76,62.23 R46.2 | IC7.16 41.03,14.36 41.91,15.24 42.76,15.24 R55.2 v43.18,16.51 | CAL3.E CAL2.E CAL1.E 43.82,32.73 46.23,35.14 46.23,38.52 45.63,39.12 44.7,39.12 43.98,39.84 43.98,61.01 R46.2 | ISP.2 14.07,30.38 16.51,30.38 | 16.51,30.38 21.71,30.38 21.86,30.53 21.86,31 U1.18 22.13,32.67 22.66,33.2 22.66,39.11 | 23.4,40.74 23.34,40.74 23.2,40.59 23.2,40.12 U1.6 | U1.4 24.26,40.12 24.26,40.59 24.11,40.74 23.4,40.74 | U1.6 22.66,39.59 22.66,39.11 | 19.66,47.5 18.63,47.5 17.4,46.27 17.4,39.59 18.02,38.96 22.52,38.96 22.66,39.11 | 19.66,47.5 22.35,47.5 SER.3 26.26,47.85 31.82,47.85 32.68,46.99 CO2.3 | 22.66,39.11 22.93,39.38 U1.6 | R37.2 44.45,74.51 44.45,64.77 43.18,63.5 R46.2 | Q2.2 12.87,71.29 v11.43,69.85 | v11.43,67.31 12.38,66.36 Q3.2 | v11.43,53.34 12.38,52.39 Q4.2 | v7.62,53.34 8.26,52.7 8.26,50.54 10.16,48.64 IC3.4 7.38,46.33 C6.1 5.08,43.74 4.33,42.98 4.33,41.67 4.47,41.53 5.38,41.53 6.35,40.56 6.35,37.82 5.97,37.44 5.97,35.18 5.08,34.29 5.08,31.75 5.99,30.84 5.99,23.77 4.83,22.61 3.9,22.61 3.3,22.01 3.3,18.63 4.04,17.89 10.05,17.89 11.92,16.02 11.92,6.7 12.87,5.74 Q5.2 | v15.22,52.07 15.5,51.79 15.5,51.65 19.66,47.5 | 16.51,30.38 v16.51,24.13 | v16.16,21.68 17.3,21.68 IC1.8 | v31.75,39.57 30.9,40.42 R14.2 30.9,42.33 v31.75,43.18 | v34.29,39.37 34.29,36.53 33.04,35.28 32.05,35.28 IC2.8 31.69,33.71 v31.75,33.65 | v26.67,41.91 25.4,41.91 24.13,43.18 v22.86,43.18
  Top 0.203: v22.86,41.28 23.4,40.74
  Bottom 0.203: v11.43,69.85 v11.43,67.31 v11.43,53.34 | v11.43,53.34 v7.62,53.34 | v11.43,53.34 12.7,52.07 v15.22,52.07 | v43.18,16.51 43.23,16.51 45.39,18.67 45.39,22.55 CAL1.E | v16.51,24.13 16.51,21.9 16.29,21.68 v16.16,21.68 | v31.75,39.57 31.95,39.37 v34.29,39.37 | CAL3.E 31.11,29.8 30.84,30.08 30.84,32.74 v31.75,33.65 | v31.75,43.18 30.48,41.91 v26.67,41.91 | v22.86,43.18 v22.86,41.28

### Text on the board
tPlace: + D - | GN / NC / 5V / TX / RX / RS | TO CALIBRATE O2: / 1. EXPOSE SENSOR TO 100% O2. ADJUST GAIN TO SHOW 100% / 2. EXPOSE SENSOR TO 21% O2. ADJUST CAL TO SHOW 21% | + - | - + | + - | + -
bPlace: OXY 1 | OXY 2 | OXY 3 | CO2
bNames: C.K.